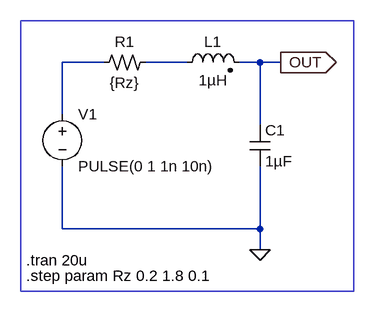
[diagram p0: schematic Switch-Mode_Power_Supplies_-_Basso-_Figure_1-50.asc]
Switch-Mode_Power_Supplies_-_Basso-_Figure_1-50.asc, the LTspice schematic file:
Version 4
SHEET 1 880 1052
WIRE -1248 -608 -1312 -608
WIRE -1120 -608 -1184 -608
WIRE -1008 -608 -1040 -608
WIRE -976 -608 -1008 -608
WIRE -1312 -528 -1312 -608
WIRE -1008 -512 -1008 -608
WIRE -1312 -352 -1312 -448
WIRE -1008 -352 -1008 -448
WIRE -1008 -352 -1312 -352
WIRE -1008 -320 -1008 -352
FLAG -1008 -320 0
FLAG -976 -608 OUT
IOPIN -976 -608 Out
SYMBOL res2 -1184 -624 R90
WINDOW 0 0 32 VBottom 0
WINDOW 3 32 32 VTop 0
SYMATTR InstName R1
SYMATTR Value {Rz}
SYMBOL ind2 -1136 -592 R270
WINDOW 0 32 56 VTop 0
WINDOW 3 4 56 VBottom 0
SYMATTR InstName L1
SYMATTR Value 1µH
SYMBOL cap -1024 -512 R0
SYMATTR InstName C1
SYMATTR Value 1µF
SYMBOL voltage -1312 -544 R0
WINDOW 123 0 0 Left 0
WINDOW 39 0 0 Left 0
SYMATTR InstName V1
SYMATTR Value PULSE(0 1 1n 10n)
TEXT -1368 -304 Left 0 !.tran 20u
TEXT -1368 -280 Left 0 !.step param Rz 0.2 1.8 0.1
RECTANGLE Normal -1376 -672 -864 -256

The netlist it stands for:
* Switch-Mode_Power_Supplies_-_Basso-_Figure_1-50.asc
R1 N002 N001 {Rz}
L1 N002 OUT 1µH
C1 OUT 0 1µF
V1 N001 0 PULSE(0 1 1n 10n)
.tran 20u
.step param Rz 0.2 1.8 0.1
.backanno
.end